# EAGLE board vrs6907 (EAGLE 6.6.0)
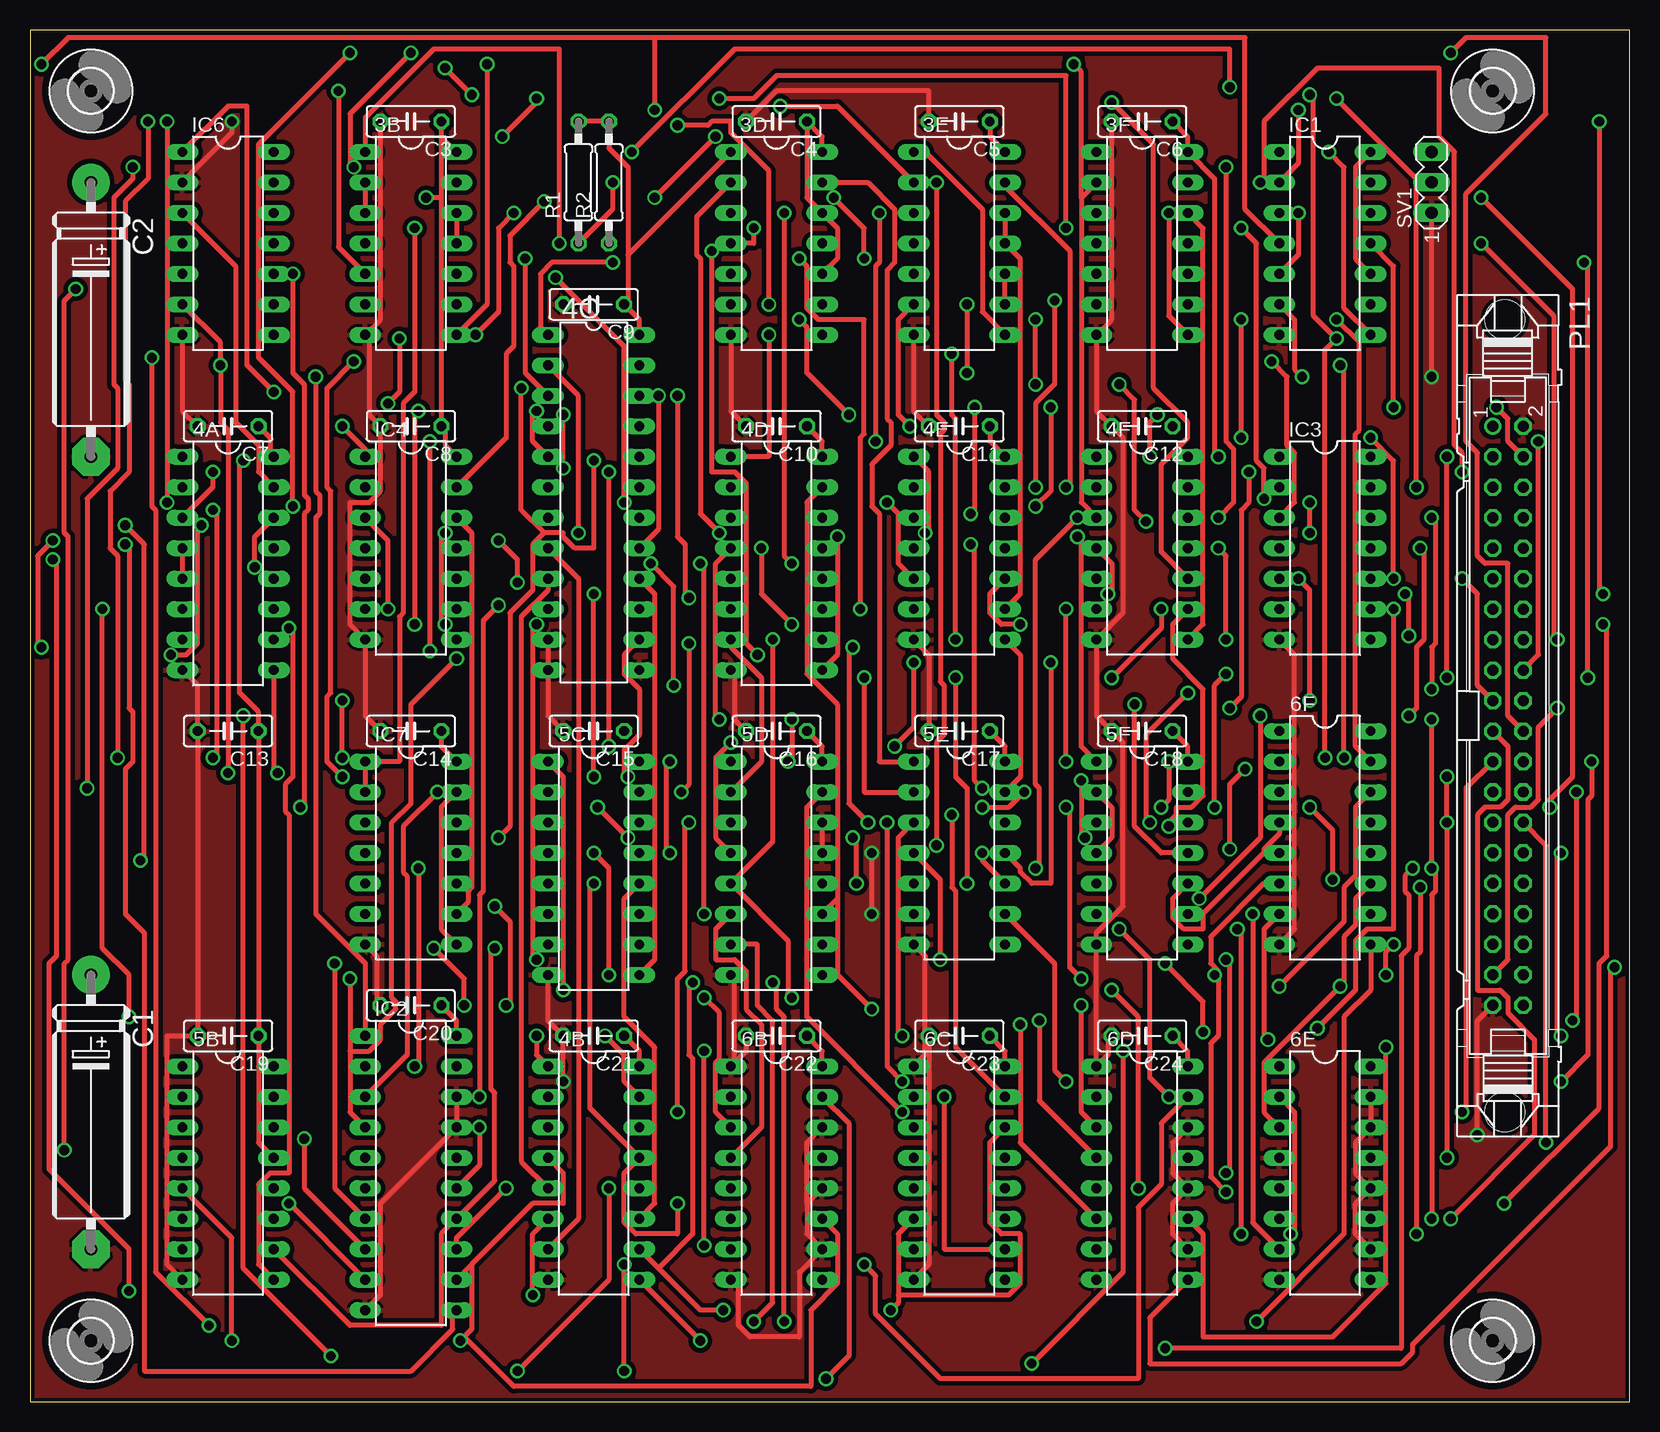
[diagram p1: board, top side]
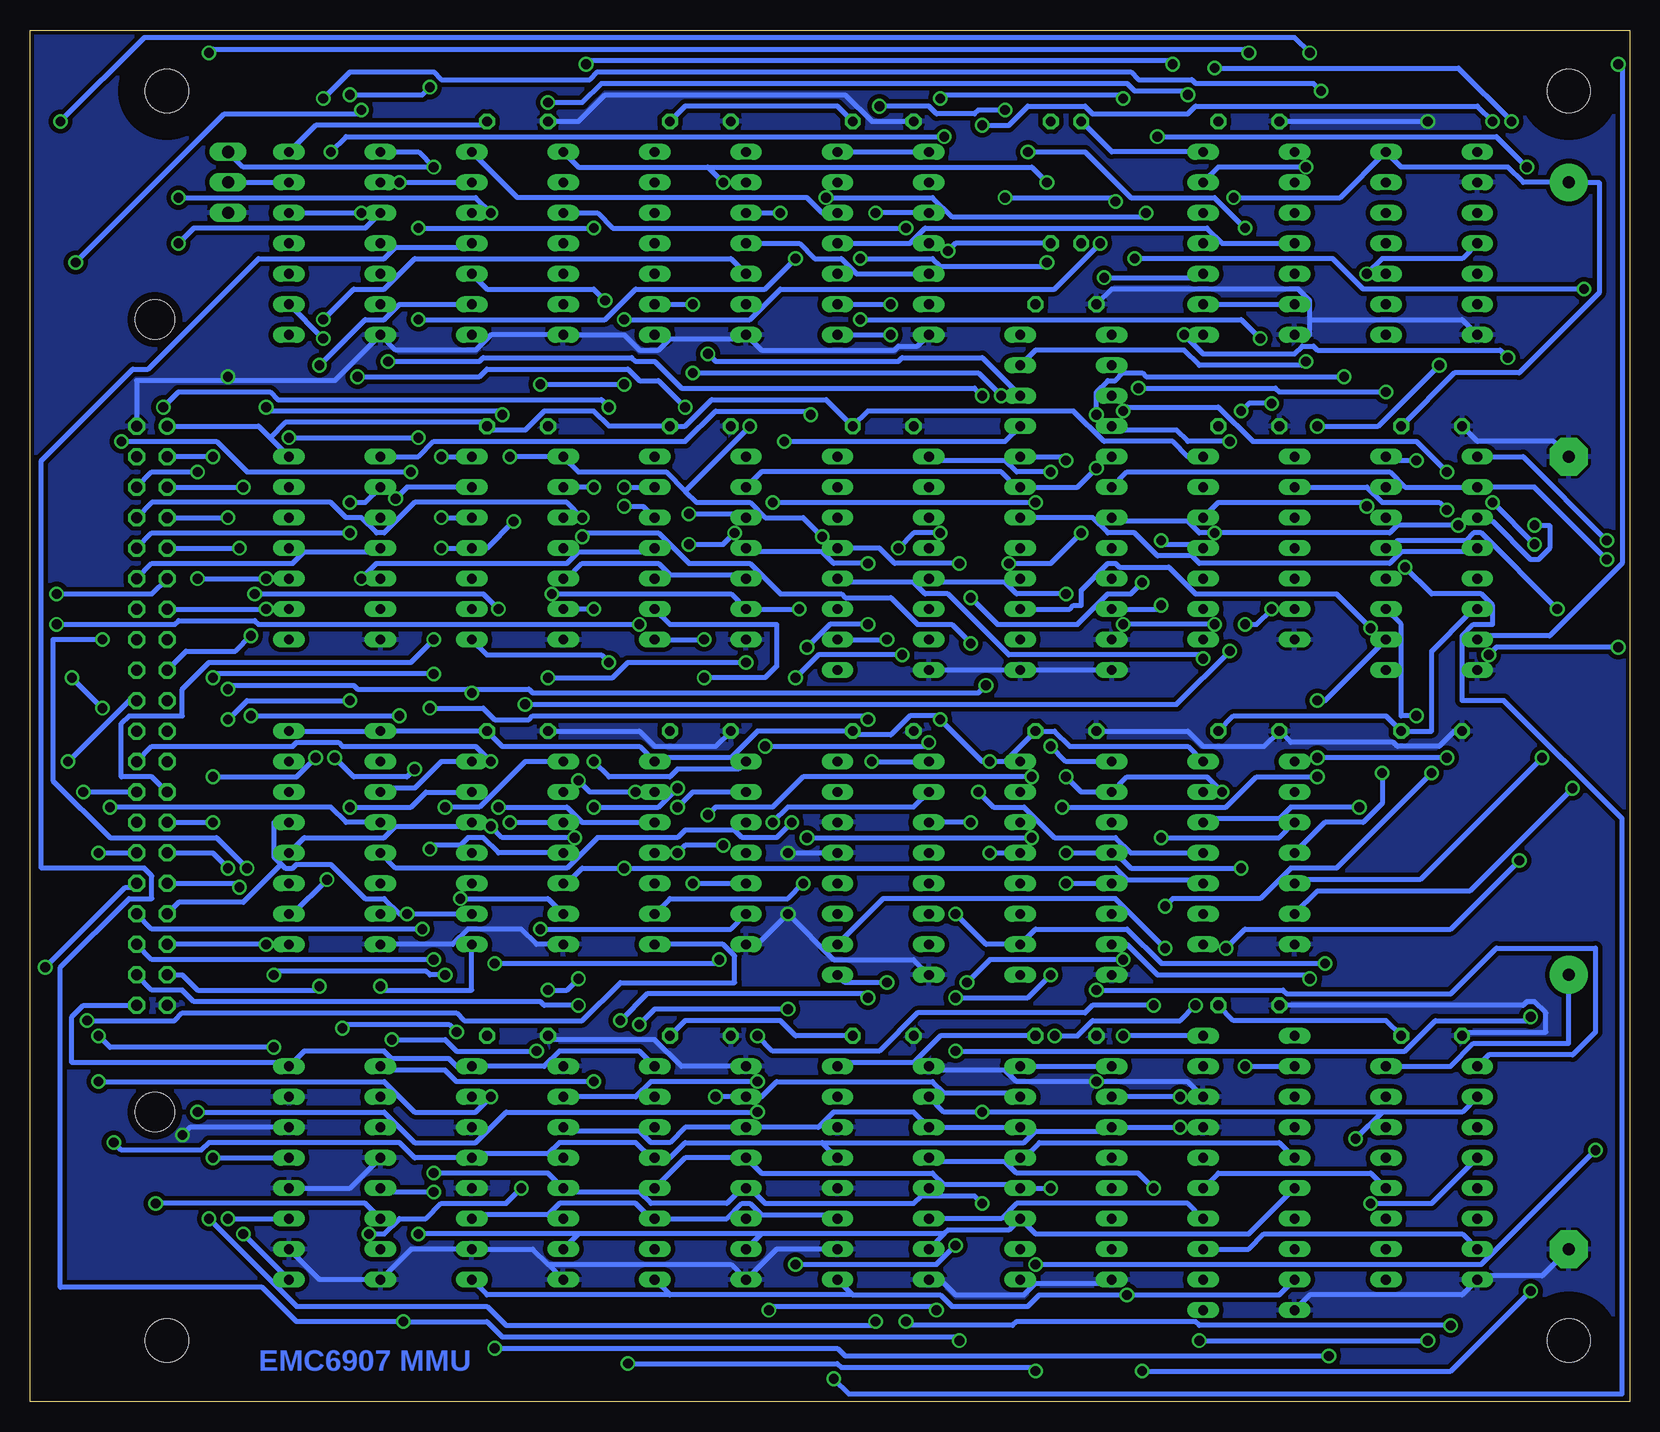
[diagram p2: board, bottom side, seen from below]

Size 133.35 x 114.3 mm. Coordinates in mm from the lower left corner, seen from the top.
Outline: 0,0 133.35,0 133.35,114.3 0,114.3 0,0
Copper layers (1+16): Top 0.035mm / dielectric 1.5mm / Bottom 0.035mm
Design rules "16mils": minimum track width 16mil, minimum drill 32mil, track to track 15mil, track to pad 10mil, pad to pad 10mil, via to via 10mil, smd to smd 10mil, copper to edge 13mil, drill to drill 10mil, minimum pad ring 10mil, minimum via ring 8mil, stop-mask expansion 0mil, vias tented up to drill 0mil, thermal gap 10mil

## Footprints (pad centres in the part's own frame; a part is rotated, then mirrored left to right if it is on the bottom)
DIL14 = drill 0.813 long: 1 -7.62,-3.81; 2 -5.08,-3.81; 3 -2.54,-3.81; 4 0,-3.81; 5 2.54,-3.81; 6 5.08,-3.81; 7 7.62,-3.81; 8 7.62,3.81; 9 5.08,3.81; 10 2.54,3.81; 11 0,3.81; 12 -2.54,3.81; 13 -5.08,3.81; 14 -7.62,3.81
DIL16 = drill 0.813 long: 1 -8.89,-3.81; 2 -6.35,-3.81; 3 -3.81,-3.81; 4 -1.27,-3.81; 5 1.27,-3.81; 6 3.81,-3.81; 7 6.35,-3.81; 8 8.89,-3.81; 9 8.89,3.81; 10 6.35,3.81; 11 3.81,3.81; 12 1.27,3.81; 13 -1.27,3.81; 14 -3.81,3.81; 15 -6.35,3.81; 16 -8.89,3.81
DIL24-3 = drill 0.813 long: 1 -13.97,-3.81; 2 -11.43,-3.81; 3 -8.89,-3.81; 4 -6.35,-3.81; 5 -3.81,-3.81; 6 -1.27,-3.81; 7 1.27,-3.81; 8 3.81,-3.81; 9 6.35,-3.81; 10 8.89,-3.81; 11 11.43,-3.81; 12 13.97,-3.81; 13 13.97,3.81; 14 11.43,3.81; 15 8.89,3.81; 16 6.35,3.81; 17 3.81,3.81; 18 1.27,3.81; 19 -1.27,3.81; 20 -3.81,3.81; 21 -6.35,3.81; 22 -8.89,3.81; 23 -11.43,3.81; 24 -13.97,3.81
E22-6 = drill 1.016 pad 3.15: + -11.43,0 | drill 1.016 pad 3.15 octagon: - 11.43,0
C050-025X075 = drill 0.813 octagon: 1 -2.54,0; 2 2.54,0
DIL20 = drill 0.813 long: 1 -11.43,-3.81; 2 -8.89,-3.81; 3 -6.35,-3.81; 4 -3.81,-3.81; 5 -1.27,-3.81; 6 1.27,-3.81; 7 3.81,-3.81; 8 6.35,-3.81; 9 8.89,-3.81; 10 11.43,-3.81; 11 11.43,3.81; 12 8.89,3.81; 13 6.35,3.81; 14 3.81,3.81; 15 1.27,3.81; 16 -1.27,3.81; 17 -3.81,3.81; 18 -6.35,3.81; 19 -8.89,3.81; 20 -11.43,3.81
40V = drill 0.914: 1 -24.13,-1.27 | drill 0.914 octagon: 2 -24.13,1.27; 3 -21.59,-1.27; 4 -21.59,1.27; 5 -19.05,-1.27; 6 -19.05,1.27; 7 -16.51,-1.27; 8 -16.51,1.27; 9 -13.97,-1.27; 10 -13.97,1.27; 11 -11.43,-1.27; 12 -11.43,1.27; 13 -8.89,-1.27; 14 -8.89,1.27; 15 -6.35,-1.27; 16 -6.35,1.27; 17 -3.81,-1.27; 18 -3.81,1.27; 19 -1.27,-1.27; 20 -1.27,1.27; 21 1.27,-1.27; 22 1.27,1.27; 23 3.81,-1.27; 24 3.81,1.27; 25 6.35,-1.27; 26 6.35,1.27; 27 8.89,-1.27; 28 8.89,1.27; 29 11.43,-1.27; 30 11.43,1.27; 31 13.97,-1.27; 32 13.97,1.27; 33 16.51,-1.27; 34 16.51,1.27; 35 19.05,-1.27; 36 19.05,1.27; 37 21.59,-1.27; 38 21.59,1.27; 39 24.13,-1.27; 40 24.13,1.27 | hole 3.302: 33.02,-0.254; -33.02,-0.254
0207/10 = drill 0.813 octagon: 1 -5.08,0; 2 5.08,0
MA03-1 = drill 1.016 long: 1 -2.54,0; 2 0,0; 3 2.54,0
3,6 = hole 3.6: 0,0

## Placement (x,y rotation side)
3B  7414N  [DIL14]  31.75,96.52 270 top
3D  74LS74N  [DIL14]  62.23,96.52 270 top
3E  74LS10N  [DIL14]  77.47,96.52 270 top
3F  74LS00N  [DIL14]  92.71,96.52 270 top
4A  74LS138N  [DIL16]  16.51,69.85 270 top
4B  74LS174N  [DIL16]  46.99,19.05 270 top
4C  20L10  [DIL24-3]  46.99,74.93 270 top
4D  74LS175N  [DIL16]  62.23,69.85 270 top
4E  74LS02N  [DIL14]  77.47,71.12 270 top
4F  74LS04N  [DIL14]  92.71,71.12 270 top
5B  74LS175N  [DIL16]  16.51,19.05 270 top
5C  74LS175N  [DIL16]  46.99,44.45 270 top
5D  74LS257N  [DIL16]  62.23,44.45 270 top
5E  7407N  [DIL14]  77.47,45.72 270 top
5F  74LS32N  [DIL14]  92.71,45.72 270 top
6B  74LS365N  [DIL16]  62.23,19.05 270 top
6C  74LS365N  [DIL16]  77.47,19.05 270 top
6D  74LS365N  [DIL16]  92.71,19.05 270 top
6E  74LS365N  [DIL16]  107.95,19.05 270 top
6F  74LS174N  [DIL16]  107.95,46.99 270 top
C1  27uf  [E22-6]  5.08,24.13 270 top
C2  27uf  [E22-6]  5.08,90.17 270 top
C3  .01uf  [C050-025X075]  31.75,106.68 180 top
C4  .01uf  [C050-025X075]  62.23,106.68 180 top
C5  .01uf  [C050-025X075]  77.47,106.68 180 top
C6  .01uf  [C050-025X075]  92.71,106.68 180 top
C7  .01uf  [C050-025X075]  16.51,81.28 180 top
C8  .01uf  [C050-025X075]  31.75,81.28 180 top
C9  .01uf  [C050-025X075]  46.99,91.44 180 top
C10  .01uf  [C050-025X075]  62.23,81.28 180 top
C11  .01uf  [C050-025X075]  77.47,81.28 180 top
C12  .01uf  [C050-025X075]  92.71,81.28 180 top
C13  .01uf  [C050-025X075]  16.51,55.88 180 top
C14  .01uf  [C050-025X075]  31.75,55.88 180 top
C15  .01uf  [C050-025X075]  46.99,55.88 180 top
C16  .01uf  [C050-025X075]  62.23,55.88 180 top
C17  .01uf  [C050-025X075]  77.47,55.88 180 top
C18  .01uf  [C050-025X075]  92.71,55.88 180 top
C19  .01uf  [C050-025X075]  16.51,30.48 180 top
C20  .01uf  [C050-025X075]  31.75,33.02 180 top
C21  .01uf  [C050-025X075]  46.99,30.48 180 top
C22  .01uf  [C050-025X075]  62.23,30.48 180 top
C23  .01uf  [C050-025X075]  77.47,30.48 180 top
C24  .01uf  [C050-025X075]  92.71,30.48 180 top
IC1  74LS74N  [DIL14]  107.95,96.52 270 top
IC2  74LS374N  [DIL20]  31.75,19.05 270 top
IC3  7407N  [DIL14]  107.95,71.12 270 top
IC4  74LS32N  [DIL14]  31.75,71.12 270 top
IC6  74LS74N  [DIL14]  16.51,96.52 270 top
IC7  74LS10N  [DIL14]  31.75,45.72 270 top
PL1  [40V]  123.19,57.15 270 top
R1  [0207/10]  45.72,101.6 90 top
R2  [0207/10]  48.26,101.6 90 top
SV1  [MA03-1]  116.84,101.6 90 top
U$1  [3,6]  5.08,109.22 0 top
U$2  [3,6]  121.92,109.22 0 top
U$3  [3,6]  5.08,5.08 0 top
U$4  [3,6]  121.92,5.08 0 top

## Tracks (layer width: path | path; a pad name or v marks a point on that pad's centre or on a via)
!2X4
  Top 0.406: 4A.4 4A.5
  Bottom 0.406: 4C.18 44.77,73.66 43.5,72.39 41.27,72.39 39.37,70.48 36.51,70.48 35.88,69.85 20,69.85 19.05,70.8 13.02,70.8 4A.4
!C0  (via drill 0.81)
  Top 0.406: v94.3,49.53 94.93,50.16 v94.93,53.34
  Bottom 0.406: 5E.12 87.31,48.26 88.58,49.53 v94.3,49.53 | v94.93,53.34 96.2,54.61 107.31,54.61 107.63,54.93 111.12,54.93 111.44,54.61 123.19,54.61 PL1.24
!C1  (via drill 0.81)
  Top 0.406: v128.59,31.75 128.91,32.07 v128.91,50.8
  Bottom 0.406: 5E.8 75.56,38.1 74.61,37.15 74.61,34.92 84.14,34.92 87.31,31.75 97.16,31.75 97.79,32.38 120.65,32.38 121.28,31.75 v128.59,31.75 | PL1.26 v128.91,50.8
!CINT
  Top 0.406: 4A.15 19.05,77.47 19.05,79.69 17.14,81.6 17.14,94.61 IC6.3
!CPUDEVSEL  (via drill 0.81)
  Top 0.406: v54.29,50.8 54.93,51.44 v54.93,63.18 | v87.31,72.07 87.63,71.75 87.63,54.61 5F.1 | v118.11,60.33 v118.11,78.74 | v99.69,60.64 98.74,59.69 v98.74,49.53
  Bottom 0.406: IC7.11 41.59,45.72 42.86,46.99 47.94,46.99 50.48,49.53 53.02,49.53 v54.29,50.8 | v54.93,63.18 56.52,64.77 59.37,64.77 61.59,66.99 65.41,66.99 65.72,67.31 70.8,67.31 73.34,69.85 78.42,69.85 80.96,72.39 87,72.39 v87.31,72.07 | v118.11,78.74 PL1.3 | v118.11,60.33 117.79,60.64 v99.69,60.64 | v98.74,49.53 95.89,49.53 92.08,53.34 5F.1
!CPUSWSEL  (via drill 0.81)
  Top 0.406: v87.31,73.66 83.82,70.17 83.82,51.44 84.14,51.12 84.14,44.77 v83.82,44.45
  Bottom 0.406: IC7.10 35.88,43.5 41.91,43.5 42.86,44.45 v83.82,44.45 87.31,44.45 88.58,43.18 5F.5 | PL1.8 123.19,74.93 108.27,74.93 107,73.66 105.73,73.66 104.46,72.39 103.82,72.39 101.28,74.93 88.58,74.93 v87.31,73.66
!CUF  (via drill 0.81)
  Top 0.406: v20.64,52.39 20.32,52.7 4A.9
  Bottom 0.406: IC7.4 25.4,48.26 22.23,48.26 20.64,49.85 v20.64,52.39
!DEVSEL  (via drill 0.81)
  Top 0.406: v93.34,48.26 93.03,48.58 93.03,55.56 v96.52,59.05 | v116.84,59.37 116.84,62.87 117.16,63.18 117.16,73.34 v116.84,73.66 | 4C.2 45.72,83.82 v45.72,72.39 | v51.75,69.85 53.66,67.94 v53.66,59.69
  Bottom 0.406: v93.34,48.26 5F.3 | 96.84,59.37 106.05,59.37 106.36,59.69 116.52,59.69 v116.84,59.37 | PL1.7 v116.84,73.66 | v45.72,72.39 48.26,69.85 v51.75,69.85 | v53.66,59.69 54.29,59.05 91.44,59.05 91.76,59.37 96.84,59.37 | 96.84,59.37 v96.52,59.05
!ENSF  (via drill 0.81)
  Top 0.406: IC2.1 27.94,36.51 23.81,40.64 23.81,73.66 24.13,73.98 24.13,75.56 23.81,75.88 v23.81,85.41 | v44.45,77.79 v44.45,82.23
  Bottom 0.406: v23.81,85.41 40.32,85.41 40.64,85.72 42.23,85.72 42.86,85.09 43.5,85.09 44.45,84.14 v44.45,82.23 | v44.45,77.79 46.04,76.2 4C.19 51.12,76.2 52.39,77.47 72.39,77.47 4E.2
!ERROR  (via drill 0.81)
  Top 0.406: v22.54,49.53 22.86,49.85 22.86,73.98 23.18,74.3 23.18,75.25 22.86,75.56 22.86,84.77 21.91,85.72 v21.91,93.98
  Bottom 0.406: IC7.12 35.24,48.58 29.21,48.58 28.26,49.53 v22.54,49.53 | v21.91,93.98 20.64,95.25 13.97,95.25 IC6.4
!GTF  (via drill 0.81)
  Top 0.406: 5E.13 82.55,52.07 82.55,62.23 4E.8 | v76.83,87.31 76.83,82.23 77.15,81.92 v77.15,63.5
  Bottom 0.406: 4C.22 53.98,87 60.64,87 60.96,86.68 76.2,86.68 v76.83,87.31 | 4E.8 v77.15,63.5
!INHIBIT  (via drill 0.81)
  Top 0.406: 3E.12 3E.11 82.55,95.25 82.55,67.31 4E.9 | v78.11,43.18 78.11,51.12 77.15,52.07 v77.15,60.33
  Bottom 0.406: v78.11,43.18 5E.5 | v77.15,60.33 72.07,60.33 71.12,61.28 71.12,64.77 80.01,64.77 4E.9
!INHSET  (via drill 0.81)
  Top 0.406: 4C.17 52.39,72.71 v52.39,83.82 | v78.11,91.44 v78.11,85.72 | 3E.9 3E.10
  Bottom 0.406: v52.39,83.82 54.29,85.72 v78.11,85.72 | 3E.9 v78.11,91.44
!INTGNT  (via drill 0.81)
  Top 0.406: v7.3,53.66 7.3,70.48 6.67,71.12 6.67,75.88 8.26,77.47 8.26,84.77 7.94,85.09 7.94,100.01 9.84,101.92 v9.84,106.68 | v36.83,108.9 v34.61,111.12 | v90.17,108.27 93.66,104.78 93.66,84.45 96.52,81.6 96.52,80.33 94.3,78.11 94.3,70.8 4F.10
  Bottom 0.406: IC7.5 27.62,43.5 17.46,43.5 v7.3,53.66 | v9.84,106.68 14.29,111.12 v34.61,111.12 | v36.83,108.9 37.15,109.22 41.27,109.22 41.91,109.86 85.72,109.86 87.31,108.27 v90.17,108.27
!INTREQ  (via drill 0.81)
  Top 0.406: 5E.4 75.88,43.5 v75.88,36.83 | v94.61,36.51 97.79,33.34 v97.79,30.8 | v107.31,31.11 110.49,34.29 110.49,38.42 111.44,39.37 113.67,39.37 v113.67,66.04
  Bottom 0.406: v75.88,36.83 76.2,36.51 v94.61,36.51 | v97.79,30.8 98.42,31.43 107,31.43 v107.31,31.11 | PL1.13 v113.67,66.04
!IOCLR  (via drill 0.81)
  Top 0.406: v39.05,46.99 40.01,47.94 40.01,65.72 41.91,67.63 41.91,71.44 42.86,72.39 | 42.86,72.39 44.45,72.39 44.45,72.07 45.4,71.12 46.99,71.12 v46.99,78.42 | IC6.1 16.51,107.95 18.1,107.95 18.1,86.36 v20.32,84.14 | v40.96,84.45 40.96,74.3 42.86,72.39
  Bottom 0.406: IC7.3 29.21,46.99 v39.05,46.99 | v46.99,78.42 47.31,78.74 4C.20 | v20.32,84.14 29.21,84.14 29.53,84.45 v40.96,84.45
!MEMSEL  (via drill 0.81)
  Top 0.406: v83.82,74.61 85.09,75.88 v85.09,82.87 | v122.24,82.87 123.19,81.92 123.19,80.01 PL1.4
  Bottom 0.406: 4E.12 82.23,74.61 v83.82,74.61 | v85.09,82.87 85.72,83.5 112.71,83.5 113.35,84.14 120.97,84.14 v122.24,82.87
!RDF  (via drill 0.81)
  Top 0.406: 4A.14 18.73,72.07 v18.73,69.53 | v66.36,1.91 68.26,3.81 68.26,23.18 6B.15
  Bottom 0.406: v18.73,69.53 16.51,67.31 12.38,67.31 11.43,66.36 11.43,64.77 13.02,64.77 13.97,63.82 13.97,58.42 10.48,58.42 0.64,48.58 0.64,0.64 65.09,0.64 v66.36,1.91
!RIF  (via drill 0.81)
  Top 0.406: v6.03,66.04 6.03,37.78 8.26,35.56 v8.26,32.07 | v56.2,13.02 v56.2,29.21 | v69.53,11.43 70.48,10.48 70.48,7.3 75.88,1.91 92.39,1.91 92.39,16.19 94.3,18.1 94.3,23.18 6D.15
  Bottom 0.406: 4A.13 20,71.44 19.68,71.44 19.37,71.75 13.65,71.75 13.02,72.39 12.38,72.39 v6.03,66.04 | v8.26,32.07 8.57,31.75 16.19,31.75 18.73,29.21 v56.2,29.21 | v56.2,13.02 57.78,11.43 v69.53,11.43
!RMEN  (via drill 0.81)
  Top 0.406: v86.36,26.67 85.41,27.62 85.41,36.51 5E.9 | v26.99,86.68 24.77,84.45 24.77,76.2 25.08,75.88 25.08,59.05 24.77,58.74 24.77,53.34 v26.04,52.07 | v49.85,46.99 v47.31,49.53 | v68.58,46.99 68.9,46.67 v68.9,43.18
  Bottom 0.406: 6E.1 103.82,27.62 98.74,27.62 97.79,26.67 v86.36,26.67 | 4C.23 49.53,87.63 37.15,87.63 35.88,86.36 27.3,86.36 v26.99,86.68 | v26.04,52.07 31.11,52.07 33.66,49.53 v47.31,49.53 | v68.58,46.99 v49.85,46.99 | v68.9,43.18 70.17,41.91 80.01,41.91 5E.9
!RMF  (via drill 0.81)
  Top 0.406: v17.78,57.15 17.78,11.11 v25.08,3.81 | v94.61,4.45 114.3,4.45 114.3,37.15 114.94,37.78 114.94,42.23 114.62,42.55 114.62,43.81 v115.25,44.45 | v127.32,63.5 127,63.82 127,90.49 v120.97,96.52
  Bottom 0.406: 4A.11 19.05,64.77 19.05,57.15 v17.78,57.15 | v25.08,3.81 65.41,3.81 66.04,4.45 v94.61,4.45 | v115.25,44.45 117.79,46.99 126.68,46.99 131.44,51.75 131.44,63.5 v127.32,63.5 | v120.97,96.52 119.7,97.79 105.41,97.79 IC1.3
!RUNHLT
  Bottom 0.406: IC3.4 104.46,70.8 110.49,70.8 111.44,69.85 123.19,69.85 PL1.12
!SELIR  (via drill 0.81)
  Top 0.406: 6C.15 77.15,29.53 77.15,42.55 76.83,42.86 v76.83,48.9 | v49.85,52.07 49.53,52.39 49.53,54.29 50.8,55.56 50.8,59.37 49.53,60.64 49.53,62.23 4C.14
  Bottom 0.406: v76.83,48.9 76.2,49.53 71.44,49.53 68.9,52.07 v49.85,52.07
!SINT  (via drill 0.81)
  Top 0.406: v26.04,53.66 v26.04,58.42 | v15.24,53.66 15.56,53.98 15.56,73.98 v15.24,74.3
  Bottom 0.406: 4A.10 25.4,58.42 v26.04,58.42 | v15.24,53.66 v26.04,53.66 | v15.24,74.3 15.88,74.93 20.64,74.93 21.91,76.2 IC4.2
!SKP  (via drill 0.81)
  Top 0.406: v106.68,72.39 v106.68,74.93
  Bottom 0.406: IC3.2 105.41,74.93 v106.68,74.93 | v106.68,72.39 123.19,72.39 PL1.10
!SUF  (via drill 0.81)
  Top 0.406: v0.95,111.44 3.17,113.67 52.07,113.67 | 52.07,113.67 101.28,113.67 101.28,99.38 IC1.4 | 3E.2 67.31,107.95 v62.55,107.95 | 52.07,113.67 v52.07,107.63
  Bottom 0.406: 4A.7 12.38,63.82 6.67,63.82 0.64,69.85 0.64,111.44 v0.95,111.44 | v62.55,107.95 58.42,107.95 57.78,107.31 54.61,107.31 54.29,107.63 v52.07,107.63
!SWSEL  (via drill 0.81)
  Top 0.406: v97.47,41.91 102.55,46.99 v102.55,57.15 | v114.94,57.15 115.57,57.78 115.57,62.87 116.2,63.5 116.2,70.8 v115.89,71.12
  Bottom 0.406: 5F.6 90.17,41.91 v97.47,41.91 | v114.94,57.15 v102.55,57.15 | PL1.9 v115.89,71.12
!UB  (via drill 0.81)
  Top 0.406: v78.42,73.98 78.74,74.3 v78.74,82.87 | v106.05,85.41 105.41,86.04 105.41,90.17 IC1.6
  Bottom 0.406: 4E.3 73.98,73.98 v78.42,73.98 | v78.74,82.87 80.96,85.09 82.55,85.09 83.5,86.04 95.25,86.04 95.89,85.41 v106.05,85.41
!UIF  (via drill 0.81)
  Top 0.406: IC6.6 15.88,88.27 v15.88,86.36 15.88,81.6 16.51,80.96 v16.51,52.39 | v26.04,81.28 27.94,79.38 IC4.1 | 5E.3 72.39,46.99 72.39,30.8 v72.71,30.48 | v39.69,33.02 40.01,33.34 40.01,40.01 v38.73,41.27
  Bottom 0.406: v15.88,86.36 20.95,81.28 v26.04,81.28 | v72.71,30.48 71.44,29.21 62.55,29.21 59.37,32.38 45.4,32.38 44.77,33.02 v39.69,33.02 | v38.73,41.27 38.1,41.91 30.8,41.91 28.26,44.45 24.45,44.45 v16.51,52.39
!USER_MODE  (via drill 0.81)
  Top 0.406: IC4.13 39.69,80.33 39.69,87.31 40.32,87.95 40.32,94.61 40.01,94.93 40.01,97.16 v42.86,100.01 | v57.15,105.41 v52.07,100.33 | v108.27,104.14 109.54,102.87 109.54,91.12 IC1.8
  Bottom 0.406: v42.86,100.01 43.18,100.33 v52.07,100.33 | v57.15,105.41 107,105.41 v108.27,104.14
ANYJ  (via drill 0.81)
  Top 0.406: v69.85,48.26 68.26,49.85 68.26,62.55 v68.58,62.87 | v63.5,64.77 60.96,67.31 v60.96,71.12 | v57.47,72.39 55.88,73.98 55.88,95.25 55.56,95.57 55.56,98.74 3D.2
  Bottom 0.406: 6F.5 102.87,44.45 88.58,44.45 86.04,46.99 79.38,46.99 78.74,47.62 74.61,47.62 73.98,46.99 71.12,46.99 v69.85,48.26 | v68.58,62.87 66.67,64.77 v63.5,64.77 | v60.96,71.12 59.69,72.39 v57.47,72.39
CLKDF  (via drill 0.81)
  Top 0.406: 5B.9 19.05,11.43 19.05,18.1 20,19.05 21.59,19.05 21.59,48.9 21.27,49.21 21.27,51.44 21.91,52.07 21.91,64.14 v21.59,64.45
  Bottom 0.406: v21.59,64.45 24.45,67.31 36.2,67.31 38.42,69.53 42.55,69.53 42.86,69.85 43.5,69.85 45.72,67.63 45.72,66.36 46.35,66.36 46.67,66.04 4C.15
CLKIB
  Top 0.406: 5C.9 52.07,36.83 52.07,67.31 4C.16
CLKIF  (via drill 0.81)
  Top 0.406: v70.48,80.01 70.48,94.61 70.8,94.93 v70.8,99.06
  Bottom 0.406: 4C.21 52.07,80.01 v70.48,80.01 | 3E.3 v70.8,99.06
DATAF  (via drill 0.81)
  Top 0.406: v63.18,53.34 63.5,53.66 v63.5,56.83 | v100.01,57.78 100.97,58.74 100.97,74.3 101.6,74.93 v101.6,77.47 | v125.73,80.01 125.73,62.23 PL1.18
  Bottom 0.406: v63.18,53.34 5D.1 | v63.5,56.83 63.82,57.15 91.44,57.15 91.76,56.83 94.61,56.83 95.57,57.78 v100.01,57.78 | v101.6,77.47 115.25,77.47 117.79,80.01 v125.73,80.01
DIRJ  (via drill 0.81)
  Top 0.406: v108.9,90.17 110.81,88.27 110.81,80.96 110.49,80.64 110.49,54.61 6F.15
  Bottom 0.406: 3E.5 74.93,95.25 101.28,95.25 103.82,92.71 106.36,92.71 v108.9,90.17
DMAGNT  (via drill 0.81)
  Top 0.406: 5D.15 64.77,49.53 64.77,32.07 v72.71,24.13 | v119.38,24.13 119.7,24.45 119.7,51.12 PL1.23
  Bottom 0.406: v72.71,24.13 93.66,24.13 96.2,21.59 101.28,21.59 103.82,24.13 v119.38,24.13
DX0  (via drill 0.81)
  Top 0.406: v118.11,20.32 v118.11,48.26 v118.11,52.07 | v109.22,86.36 109.54,86.04 v109.54,53.66
  Bottom 0.406: v118.11,20.32 6E.13 | PL1.27 v118.11,48.26 | 3F.9 102.55,91.44 103.82,90.17 105.41,90.17 v109.22,86.36 | v109.54,53.66 111.12,52.07 v118.11,52.07
DX1  (via drill 0.81)
  Top 0.406: v116.84,15.24 116.84,42.23 117.16,42.55 117.16,44.13 v116.84,44.45 v116.84,56.83 | v105.73,68.58 106.68,67.63 v106.68,58.42
  Bottom 0.406: v116.84,15.24 6E.11 | v116.84,44.45 118.11,45.72 PL1.29 | 4E.11 81.6,70.8 87.63,70.8 88.58,69.85 104.46,69.85 v105.73,68.58 | v106.68,58.42 115.25,58.42 v116.84,56.83
DX2  (via drill 0.81)
  Top 0.406: v115.57,13.97 115.57,37.15 115.89,37.47 v115.89,42.86
  Bottom 0.406: v115.57,13.97 6E.9 | v115.89,42.86 116.2,43.18 PL1.31
DX3  (via drill 0.81)
  Top 0.406: 6E.7 101.92,14.92 v101.92,40.64
  Bottom 0.406: 5F.9 v101.92,40.64 102.55,40.64 103.82,41.91 105.41,41.91 108.27,44.77 111.12,44.77 111.44,44.45 112.08,44.45 112.39,44.77 | 112.39,44.77 113.03,45.4 113.03,48.26 6F.13 | PL1.33 120.97,41.59 115.57,41.59 112.39,44.77
DX4  (via drill 0.81)
  Top 0.406: v99.69,17.46 98.42,18.73 98.42,29.84 99.06,30.48 99.06,35.56 | 99.06,35.56 99.06,35.88 98.42,36.51 98.42,38.73 102.87,43.18 6F.6 | v113.67,38.1 113.03,37.47 v113.03,35.56 | 99.06,35.56 v98.74,35.56
  Bottom 0.406: 6E.5 103.82,17.46 v99.69,17.46 | v113.67,38.1 PL1.35 | v113.03,35.56 112.71,35.88 100.33,35.88 100.01,35.56 v98.74,35.56
DX5  (via drill 0.81)
  Top 0.406: 6E.3 102.87,24.13 102.87,28.26 v109.22,34.61 109.54,34.92 109.54,38.73 110.49,39.69 110.49,41.91 6F.11 | IC1.2 105.73,103.19 v105.73,107.63 | v129.54,94.93 129.86,94.61 v129.86,60.33 | v127.32,57.78 125.73,56.2 125.73,50.16 125.09,49.53 123.83,49.53 123.19,48.9 123.19,36.83 PL1.37
  Bottom 0.406: v105.73,107.63 106.05,107.31 117.16,107.31 v129.54,94.93 | v127.32,57.78 v129.86,60.33 | v109.22,34.61 109.54,34.29 119.38,34.29 120.65,35.56 PL1.37
DX6  (via drill 0.81)
  Top 0.406: v32.07,27.94 32.38,28.26 v32.38,44.45 | v87.63,33.02 87.63,24.13 6D.3 | v46.99,45.72 48.26,44.45 v48.26,35.56 | v56.2,33.66 57.47,32.38 57.47,28.57 57.15,28.26 57.15,24.13 6B.3
  Bottom 0.406: v32.07,27.94 IC2.2 | v32.38,44.45 41.59,44.45 42.86,45.72 5C.4 v46.99,45.72 | 4B.14 6B.3 59.69,24.13 66.36,24.13 67.63,22.86 6C.3 78.74,22.86 80.01,21.59 81.6,21.59 82.55,22.54 88.58,22.54 6D.3 | PL1.38 123.19,34.29 120.65,34.29 119.7,33.34 90.81,33.34 90.49,33.02 v87.63,33.02 | v48.26,35.56 50.16,33.66 v56.2,33.66
DX7  (via drill 0.81)
  Top 0.406: v46.99,43.18 46.67,42.86 46.67,24.45 4B.13 49.53,19.05 49.53,14.92 50.48,13.97 53.98,13.97 v53.98,16.51 | v99.69,36.83 100.01,36.51 100.01,19.37 v99.69,19.05
  Bottom 0.406: IC2.5 29.21,21.59 49.21,21.59 50.48,20.32 4B.13 | v46.99,43.18 5C.5 | 59.05,17.14 59.69,16.51 72.07,16.51 73.34,17.78 6C.5 73.98,17.78 75.25,16.51 81.6,16.51 82.55,17.46 88.58,17.46 6D.5 90.17,19.05 v99.69,19.05 | 59.05,17.14 6B.5 | PL1.36 123.19,36.83 v99.69,36.83 | v53.98,16.51 54.61,17.14 59.05,17.14
DX8  (via drill 0.81)
  Top 0.406: 5C.12 49.53,41.91 49.53,32.07 52.07,29.53 52.07,16.51 4B.11 | v100.65,39.37 100.97,39.05 v100.97,13.97
  Bottom 0.406: 57.15,13.97 56.83,14.29 51.75,14.29 4B.11 49.53,13.97 31.75,13.97 IC2.6 | 57.15,13.97 6B.7 | 72.39,13.97 6C.7 | 57.15,13.97 72.39,13.97 | 87.63,13.97 6D.7 | 72.39,13.97 87.63,13.97 | PL1.34 123.19,39.37 v100.65,39.37 | 87.63,13.97 v100.97,13.97
DX9  (via drill 0.81)
  Top 0.406: IC2.9 v21.59,16.51 | 4B.6 41.91,13.97 v41.91,8.89 | v132.08,36.2 131.76,35.88 131.76,21.27 115.25,4.76 115.25,4.13 114.3,3.17 93.34,3.17 93.34,6.99 6D.9
  Bottom 0.406: IC2.9 29.21,8.89 v41.91,8.89 49.21,8.89 50.16,7.94 56.52,7.94 57.47,8.89 64.77,8.89 | 6B.9 64.77,8.89 | 80.01,8.89 6C.9 | 64.77,8.89 80.01,8.89 | 5B.4 16.51,16.51 v21.59,16.51 | 6D.9 95.25,8.89 80.01,8.89 | PL1.32 124.78,42.86 125.41,42.86 v132.08,36.2
DX10  (via drill 0.81)
  Top 0.406: 36.83,11.43 41.91,16.51 44.45,16.51 44.45,19.05 4B.4 | 36.83,11.43 IC2.12 | 5B.5 16.83,13.65 v16.83,5.08 | 36.2,5.4 36.83,6.03 36.83,11.43 | v127.64,45.72 127.32,45.4 127.32,30.8 v127.64,30.48 | v113.03,29.53 113.03,9.84 108.58,5.4 97.79,5.4 97.79,13.97 6D.11 | 36.2,5.4 40.32,1.27 65.09,1.27 65.09,7.62 67.31,9.84 67.31,13.97 6B.11 | 36.2,5.4 v35.88,5.08
  Bottom 0.406: v35.88,5.08 v16.83,5.08 | 6B.11 66.36,15.56 72.39,15.56 73.34,16.51 73.98,16.51 75.25,15.24 6C.11 81.6,15.24 82.87,16.51 89.22,16.51 90.17,15.56 96.2,15.56 6D.11 | v127.64,45.72 PL1.30 | v127.64,30.48 126.68,29.53 v113.03,29.53
DX11  (via drill 0.81)
  Top 0.406: PL1.28 126.36,46.35 v126.36,21.59 | IC2.15 37.47,19.68 v37.47,22.86
  Bottom 0.406: 5B.12 21.59,19.05 34.29,19.05 IC2.15 | 67.31,21.59 6B.13 | 67.31,21.59 78.74,21.59 80.01,20.32 6C.13 81.6,20.32 82.87,21.59 89.22,21.59 90.17,20.64 96.2,20.64 6D.13 101.28,20.32 102.55,21.59 118.43,21.59 119.06,20.95 125.73,20.95 v126.36,21.59 | 67.31,21.59 50.48,21.59 49.53,22.54 43.5,22.54 4B.3 v37.47,22.86
EM0  (via drill 0.81)
  Top 0.406: 5D.4 57.15,46.99 57.15,53.66 v58.42,54.93 | v72.07,54.61 73.66,56.2 v73.66,61.59 | v90.17,60.33 94.3,64.45 v94.3,66.04 | v114.62,67.31 114.94,66.99 v114.94,63.82
  Bottom 0.406: v58.42,54.93 58.74,54.61 v72.07,54.61 | v73.66,61.59 83.5,61.59 84.77,60.33 v90.17,60.33 | v94.3,66.04 95.57,67.31 v114.62,67.31 | v114.94,63.82 116.2,62.55 120.33,62.55 PL1.17
EM1  (via drill 0.81)
  Top 0.406: 5D.7 60.64,38.1 60.64,33.02 61.91,31.75 61.91,8.26 v60.33,6.67 | v14.92,6.35 10.48,10.79 10.48,74.3 10.16,74.61 v10.16,87 | v37.15,88.9 39.05,90.81 39.05,97.79 v40.32,99.06 | v66.99,100.33 69.53,97.79 v69.53,95.25 | v100.97,80.33 v100.97,90.17 | v111.76,80.33 113.67,78.42 v113.67,68.58 | v119.38,68.58 120.65,67.31 120.65,59.69 PL1.19
  Bottom 0.406: v60.33,6.67 60.01,6.35 51.44,6.35 51.12,6.67 36.2,6.67 35.88,6.35 v14.92,6.35 | v10.16,87 10.79,87.63 26.04,87.63 26.35,87.95 27.3,87.95 27.94,87.31 35.56,87.31 v37.15,88.9 | v40.32,99.06 40.64,98.74 56.52,98.74 58.1,100.33 v66.99,100.33 | v69.53,95.25 72.07,92.71 82.87,92.71 85.41,90.17 v100.97,90.17 | v111.76,80.33 v100.97,80.33 | v119.38,68.58 v113.67,68.58
EM2  (via drill 0.81)
  Top 0.406: v61.91,34.92 62.23,34.61 62.23,32.7 62.87,32.07 v62.87,6.67 | v118.43,15.24 125.41,22.23 125.41,30.16 123.19,32.38 123.19,33.66 122.56,34.29 120.65,34.29 120.65,48.9 121.28,49.53 122.56,49.53 123.19,50.16 123.19,54.61 PL1.21
  Bottom 0.406: 5D.9 65.41,34.92 v61.91,34.92 | v62.87,6.67 63.18,6.35 93.66,6.35 95.25,7.94 111.12,7.94 v118.43,15.24
GND  (via drill 0.81)
  Top 0.406: C7.2 12.7,82.55 IC6.7 | IC6.2 16.83,105.73 v16.83,106.68 | C3.2 29.21,90.17 3B.7 28.26,88.58 28.26,82.23 C8.2 29.21,75.88 28.26,74.93 26.67,74.93 26.67,64.77 IC4.7 27.94,57.15 C14.2 | C16.2 58.74,56.83 58.74,60.64 4D.8 | 4C.11 4C.12 43.18,57.15 C15.2 | C20.2 28.89,33.34 28.89,37.15 IC7.7 | 4A.8 13.97,59.69 C13.2 C19.2 11.43,30.48 11.43,11.43 5B.8 | C10.2 58.42,82.55 3D.7 | C11.2 73.66,82.55 3E.7 | C17.2 74.93,62.23 4E.7 | C4.2 62.23,109.22 74.93,109.22 C5.2 | C6.2 90.17,90.17 3F.7 88.9,82.55 C12.2 91.12,80.33 91.12,65.72 4F.7 88.9,57.15 C18.2 91.12,54.93 91.12,41.27 88.9,39.05 5F.7 6D.1 89.85,28.89 89.85,30.16 C24.2 | v116.84,85.41 SV1.1 | 64.77,16.51 64.77,13.97 6B.10 64.14,10.79 64.14,5.4 60.01,5.4 59.05,6.35 59.05,9.53 6B.8 | 6B.12 64.77,16.51 | 6B.14 64.77,21.59 64.77,16.51 | 6E.15 6E.14 110.49,21.59 110.49,19.05 6E.12 110.49,16.51 110.49,13.97 6E.10 | PL1.39 120.65,31.75 v120.65,22.23 | 6D.14 95.25,21.59 95.25,19.05 6D.12 95.25,16.51 95.25,13.97 6D.10 | IC3.7 105.41,62.23 105.41,39.37 6F.8 | 58.74,28.26 59.69,29.21 C22.2 | 5D.8 58.74,35.24 58.74,28.26 | 58.74,28.26 6B.1 | 5D.14 5D.13 | 74.93,29.21 74.61,28.89 | 74.61,28.89 6C.1 | C23.2 74.93,29.21 | 5E.7 74.61,37.15 74.61,28.89 | v70.17,40.64 v70.17,45.72 | 5C.8 43.18,31.75 C21.2 v44.45,26.67 | IC2.18 IC2.17 29.21,16.51 29.21,8.89 IC2.10 | 6C.8 74.93,11.43 74.93,29.21
  Bottom 0.406: C7.2 12.7,80.01 6.35,80.01 C2.- | C3.2 v16.83,106.68 | C9.2 43.18,92.71 27.62,92.71 26.67,91.76 26.67,90.17 | 26.67,90.17 26.67,88.9 3B.7 | IC6.7 13.97,90.17 26.67,90.17 | 4C.12 4C.13 4D.8 | C15.2 36.83,55.88 35.56,54.61 30.48,54.61 C14.2 28.26,54.93 19.68,54.93 19.37,54.61 15.88,54.61 14.61,55.88 C13.2 | C20.2 8.89,33.02 8.57,33.34 7.94,33.34 6.99,32.38 6.99,30.8 13.65,30.8 C19.2 | 3D.7 59.37,87.95 60.96,87.95 61.28,87.63 72.39,87.63 3E.7 73.98,88.58 80.01,88.58 80.96,87.63 82.55,87.63 83.82,88.9 3F.7 94.93,88.9 96.2,87.63 102.87,87.63 IC1.7 107.95,85.09 116.84,85.09 | C17.2 76.2,54.61 81.28,54.61 82.55,55.88 C18.2 | PL1.2 124.46,85.09 116.84,85.09 | 116.84,85.09 v116.84,85.41 | C4.2 63.18,106.68 65.41,108.9 85.41,108.9 87.63,106.68 C6.2 | 4B.8 43.5,9.84 49.53,9.84 50.48,8.89 56.2,8.89 57.47,10.16 6B.8 | 6B.10 71.12,12.7 6C.8 74.93,11.43 90.17,11.43 | 6E.4 106.68,17.78 6E.12 | v120.65,22.23 120.02,22.86 6E.14 | 90.17,11.43 91.44,12.7 6D.10 101.6,12.7 6E.8 109.22,10.16 6E.10 | 90.17,11.43 6D.8 | 6F.8 98.11,38.1 96.84,39.37 92.39,39.37 91.12,38.1 5F.7 | v70.17,45.72 5D.13 | 5E.7 72.71,38.1 v70.17,40.64 66.36,36.83 59.69,36.83 5D.8 | C1.- 7.3,10.48 12.38,10.48 5B.8 13.97,8.89 26.67,8.89 IC2.10 | IC2.18 36.83,26.67 v44.45,26.67 51.12,26.67 52.07,27.62 58.1,27.62 6B.1 | C24.2 89.85,30.16 81.28,30.16 79.06,27.94 6C.1
  pour Top: 0,0 0,114.3 133.35,114.3 133.35,0
  pour Bottom: 0,0 0,114.3 133.35,114.3 133.35,0
IFETCH  (via drill 0.81)
  Top 0.406: v26.99,102.87 26.67,103.19 26.67,107.31 v31.75,112.39 | v118.43,112.39 119.7,113.67 126.36,113.67 126.36,107.31 119.7,100.65 119.7,80.01 120.65,79.06 120.65,70.48 121.28,69.85 123.19,69.85 123.19,57.15 PL1.22
  Bottom 0.406: 3B.13 34.29,102.87 v26.99,102.87 | v31.75,112.39 32.07,112.71 118.11,112.71 v118.43,112.39
INTDIS  (via drill 0.81)
  Top 0.406: v90.81,39.37 93.34,36.83 93.34,26.99 v94.93,25.4 | v127.64,26.67 129.86,28.89 129.86,50.16 130.18,50.48 v130.18,53.34
  Bottom 0.406: 5E.6 74.93,39.37 v90.81,39.37 | v94.93,25.4 96.2,24.13 101.28,24.13 103.82,26.67 v127.64,26.67 | v130.18,53.34 125.09,58.42 PL1.20
INTGNT  (via drill 0.81)
  Top 0.406: v99.06,71.12 99.69,70.48 v99.69,63.5 | 3B.1 27.94,107 33.66,112.71 44.13,112.71 v44.13,96.52 | v83.82,84.77 v83.82,90.17 | v90.81,84.77 92.08,83.5 92.08,74.3 v93.03,73.34
  Bottom 0.406: v99.06,71.12 4F.11 95.25,71.12 v93.03,73.34 | v99.69,63.5 101.6,61.59 118.43,61.59 120.65,59.37 120.65,57.15 125.09,57.15 125.73,56.52 125.73,52.07 123.19,52.07 PL1.25 | v44.13,96.52 47.94,92.71 70.8,92.71 73.34,90.17 v83.82,90.17 | v90.81,84.77 v83.82,84.77
IR3
  Bottom 0.406: 5F.12 96.84,47.94 102.87,47.94 103.82,46.99 110.49,46.99 6F.12
IR4  (via drill 0.81)
  Top 0.406: 4C.3 41.27,85.72 v41.27,95.25 | v3.81,92.71 2.86,91.76 2.86,72.39 3.17,72.07 3.17,36.83 2.86,36.51 v2.86,20.95 | v49.53,2.54 v49.53,11.43 | v83.5,3.17 91.12,10.79 v91.12,29.21 | v103.19,30.16 102.87,30.48 102.87,39.37 6F.7
  Bottom 0.406: v41.27,95.25 24.77,95.25 22.23,92.71 v3.81,92.71 | v2.86,20.95 12.38,11.43 v49.53,11.43 | v49.53,2.54 49.85,2.86 65.72,2.86 66.04,3.17 v83.5,3.17 | v91.12,29.21 97.79,29.21 98.74,30.16 v103.19,30.16
IR5  (via drill 0.81)
  Top 0.406: v106.68,49.53 108.58,47.62 v108.58,43.5
  Bottom 0.406: 5F.13 100.33,50.8 101.6,49.53 v106.68,49.53 | v108.58,43.5 111.44,40.64 6F.10
IR6  (via drill 0.81)
  Top 0.406: 4A.3 15.24,76.2 v15.24,77.47 | v42.23,82.55 41.91,82.23 41.91,80.01 4C.5 | 6C.10 76.2,12.7 v76.2,25.4 | v7.94,73.03 9.53,71.44 9.53,45.4 v9.21,45.09 | v33.66,37.78 36.2,35.24 v36.2,33.02 | v47.94,30.48 49.53,28.89 49.53,26.67 4B.15
  Bottom 0.406: v15.24,77.47 17.78,80.01 31.43,80.01 34.29,82.87 41.91,82.87 v42.23,82.55 | v76.2,25.4 6C.2 72.39,25.4 71.12,26.67 58.1,26.67 57.15,25.72 51.12,25.72 4B.15 | 4A.3 12.38,73.34 11.43,73.34 8.26,70.17 7.62,70.17 6.67,71.12 6.67,73.03 v7.94,73.03 | v9.21,45.09 14.92,39.37 32.07,39.37 v33.66,37.78 | v36.2,33.02 37.47,31.75 44.77,31.75 46.04,30.48 v47.94,30.48
IR7  (via drill 0.81)
  Top 0.406: v1.91,70.17 2.22,69.85 2.22,37.15 1.59,36.51 1.59,19.37 8.26,12.7 v8.26,9.21 | v40.64,2.54 48.26,10.16 v48.26,17.78
  Bottom 0.406: 4C.6 41.91,77.47 20,77.47 18.73,76.2 4A.2 7.94,76.2 v1.91,70.17 | 6C.12 78.74,20.32 6C.4 72.39,19.05 58.1,19.05 57.15,18.1 51.12,18.1 4B.12 v48.26,17.78 | v8.26,9.21 14.92,2.54 v40.64,2.54
IR8  (via drill 0.81)
  Top 0.406: 52.39,11.11 55.88,7.62 v57.78,7.62 | 52.39,11.11 4B.10 | v71.75,7.62 72.39,8.26 72.39,8.89 | 72.39,8.89 72.39,13.97 6C.6 | 6C.14 80.01,21.59 80.01,14.92 80.96,13.97 82.55,13.97 82.55,9.84 81.6,8.89 72.39,8.89 | v14.29,73.03 13.97,72.71 13.97,63.18 13.02,62.23 v11.75,62.23 | v0.95,62.87 0.64,63.18 0.64,70.48 v1.91,71.75 | 52.39,11.11 55.24,13.97 55.24,28.57 54.93,28.89 54.93,34.61 v55.24,34.92 | v42.23,36.83 41.91,37.15 41.91,64.45 v42.23,64.77 | v34.61,64.77 34.29,65.09 34.29,72.07 v34.61,72.39
  Bottom 0.406: v57.78,7.62 58.1,7.94 71.44,7.94 v71.75,7.62 | 4C.7 42.86,73.34 36.83,73.34 35.88,72.39 v34.61,72.39 20,72.39 19.37,73.03 v14.29,73.03 | v11.75,62.23 11.11,62.87 v0.95,62.87 | v1.91,71.75 8.89,78.74 4A.1 | v55.24,34.92 53.34,36.83 v42.23,36.83 | v34.61,64.77 v42.23,64.77
IR9
  Top 0.406: 4B.7 45.72,15.24 45.72,68.58 4C.8
IR10
  Top 0.406: 4B.5 40.96,20 40.96,65.41 43.18,67.63 4C.9
IR11  (via drill 0.81)
  Top 0.406: v37.47,25.4 37.47,42.23 37.78,42.55 37.78,65.09 v39.05,66.36
  Bottom 0.406: v37.47,25.4 4B.2 | v39.05,66.36 39.37,66.04 4C.10
LOADIF  (via drill 0.81)
  Top 0.406: 4D.9 67.31,62.23 v67.31,72.07 | 3E.6 72.39,90.17 72.39,82.23 v73.34,81.28 | IC1.11 113.67,94.61 v113.67,82.87 | v93.98,82.23 93.34,81.6 v93.34,78.74
  Bottom 0.406: v67.31,72.07 68.9,73.66 72.07,73.66 73.34,74.93 77.79,74.93 78.74,75.88 | 78.74,75.88 80.33,77.47 87.63,77.47 4F.1 v93.34,78.74 | 78.74,75.88 v73.34,81.28 | v113.67,82.87 113.35,82.55 94.3,82.55 v93.98,82.23
LOADIR  (via drill 0.81)
  Top 0.406: v55.88,5.08 4B.9 | v102.23,6.67 109.54,13.97 109.54,32.07 111.76,34.29 6F.9
  Bottom 0.406: v55.88,5.08 56.2,5.4 93.98,5.4 95.25,6.67 v102.23,6.67 111.12,6.67 113.98,9.53 130.81,9.53 130.81,36.2 125.09,41.91 123.19,41.91 123.19,43.81 123.83,44.45 132.4,44.45 132.4,78.42 124.78,86.04 123.51,86.04 114.3,95.25 103.82,95.25 102.87,96.2 96.84,96.2 3F.11
N$1
  Top 0.406: 3B.12 3B.11
N$2
  Bottom 0.406: 3B.9 3B.6
N$3  (via drill 0.81)
  Top 0.406: 4F.3 87.63,74.93 87.63,100.33 | 3F.2 87.63,100.33 | 3B.8 38.1,91.44 v38.1,111.44 | v87,111.44 87.63,110.81 87.63,100.33
  Bottom 0.406: v38.1,111.44 38.42,111.76 86.68,111.76 v87,111.44
N$4  (via drill 0.81)
  Top 0.406: v43.81,93.66 49.53,87.95 v49.53,74.93 | v71.44,74.93 72.39,73.98 72.39,69.85 4E.5
  Bottom 0.406: 4E.5 73.98,68.9 80.01,68.9 80.96,69.85 87.31,69.85 88.58,68.58 4F.5 | 3B.10 35.88,93.66 v43.81,93.66 | v71.44,74.93 v49.53,74.93
N$5  (via drill 0.81)
  Top 0.406: 5E.1 70.8,53.34 70.8,73.98 70.17,74.61 70.17,78.11 71.75,79.69 71.75,81.6 71.44,81.92 71.44,94.3 72.07,94.93 72.07,99.38 69.85,101.6 3D.13 | v86.36,53.34 v86.36,66.04
  Bottom 0.406: v86.36,66.04 4F.6 | v86.36,53.34 85.09,52.07 80.01,52.07 79.38,52.7 74.3,52.7 5E.1
N$6
  Bottom 0.406: 3D.5 64.45,93.98 65.72,95.25 67.94,95.25 69.22,96.52 3E.4
N$7  (via drill 0.81)
  Top 0.406: 5E.10 79.38,45.09 v79.38,45.72 | v75.56,46.35 75.56,54.93 76.2,55.56 76.2,59.69 75.88,60.01 75.88,80.64 76.2,80.96 76.2,81.6 75.56,82.23 v75.56,101.6 | R1.1 48.58,99.38 v48.58,101.6
  Bottom 0.406: v79.38,45.72 78.74,46.35 v75.56,46.35 | 76.83,102.87 v75.56,101.6 | 76.83,102.87 87.63,102.87 3F.1 | v48.58,101.6 49.85,102.87 76.83,102.87
N$8  (via drill 0.81)
  Top 0.406: 5E.11 82.55,44.45 82.55,44.13 83.5,43.18 85.09,43.18 v85.09,61.59 | 3F.12 97.79,97.79 97.79,64.77 4F.8
  Bottom 0.406: v85.09,61.59 85.72,62.23 95.25,62.23 4F.8
N$9  (via drill 0.81)
  Top 0.406: 5E.2 69.53,50.8 v69.53,60.33 | v60.64,62.23 59.69,63.18 59.69,76.52 58.74,77.47 56.83,77.47 v56.83,95.89 | 4F.9 95.25,64.77 95.25,61.91 97.79,59.37 97.79,50.48 96.84,49.53 95.57,49.53 95.57,48.9 94.93,48.26 v94.93,47.94 | v87.95,46.99 87.63,47.31 v87.63,51.75 | v82.87,50.8 81.6,49.53 v79.38,49.53
  Bottom 0.406: v69.53,60.33 67.63,62.23 v60.64,62.23 | v56.83,95.89 56.2,96.52 R2.1 | v94.93,47.94 93.98,46.99 v87.95,46.99 | v87.63,51.75 86.68,50.8 v82.87,50.8 | v79.38,49.53 78.11,50.8 5E.2
N$10  (via drill 0.81)
  Top 0.406: v89.85,67.31 90.17,67.63 90.17,69.85 4F.4 | 4C.1 42.55,89.53 42.55,93.98 43.5,94.93 v48.58,94.93 | v64.14,95.25 64.77,94.61 64.77,91.12 65.72,90.17 69.53,90.17 69.53,80.64 69.22,80.33 v69.22,66.04
  Bottom 0.406: v89.85,67.31 74.93,67.31 4E.6 v69.22,66.04 | v48.58,94.93 48.9,94.61 57.47,94.61 58.1,95.25 v64.14,95.25
N$11  (via drill 0.81)
  Top 0.406: v63.5,69.85 62.87,70.48 v62.87,99.06
  Bottom 0.406: 4E.4 73.34,70.8 67.31,70.8 66.36,69.85 v63.5,69.85 | 3D.3 v62.87,99.06
N$12  (via drill 0.81)
  Top 0.406: 3D.4 60.33,96.52 v60.33,97.79
  Bottom 0.406: v60.33,97.79 84.77,97.79 86.04,99.06 3F.3
N$13  (via drill 0.81)
  Top 0.406: v39.05,71.75 40.64,70.17 v40.64,68.26 | v54.93,66.99 54.61,67.31 54.61,71.44 53.98,72.07 v53.98,83.82 | v103.5,86.68 104.78,85.41 104.78,79.69 105.41,79.06 105.41,74.93 IC3.3
  Bottom 0.406: IC4.11 35.88,71.44 38.73,71.44 v39.05,71.75 | v40.64,68.26 41.59,67.31 43.5,67.31 46.04,64.77 52.7,64.77 v54.93,66.99 | v53.98,83.82 54.61,84.45 79.06,84.45 81.28,86.68 82.87,86.68 83.19,87 95.57,87 95.89,86.68 v103.5,86.68
N$14  (via drill 0.81)
  Top 0.406: v83.82,76.2 83.82,83.19 85.41,84.77 v85.41,91.76
  Bottom 0.406: v83.82,76.2 4E.13 | v85.41,91.76 86.36,92.71 95.25,92.71 3F.10
N$15  (via drill 0.81)
  Top 0.406: 4E.10 80.01,67.31 80.01,65.72 80.96,64.77 v82.55,64.77 | v131.13,64.77 131.44,64.45 131.44,37.15 130.81,36.51 130.81,24.45 v122.87,16.51
  Bottom 0.406: v82.55,64.77 114.3,64.77 114.62,65.09 120.97,65.09 121.28,64.77 v131.13,64.77 | v122.87,16.51 105.41,16.51 6E.6
N$16  (via drill 0.81)
  Top 0.406: v99.06,73.66 100.33,74.93 100.33,79.38 99.69,80.01 v99.69,102.87
  Bottom 0.406: v99.06,73.66 4F.12 | IC1.1 100.97,104.14 v99.69,102.87 115.57,102.87 SV1.3
N$17  (via drill 0.81)
  Top 0.406: 4E.1 74.93,77.47 74.93,72.71 v74.61,72.39 | v78.42,71.44 78.74,71.12 78.74,51.75 v79.38,51.12 | v86.36,49.53 86.68,49.21 86.68,36.2 v87.63,35.24 | v90.17,34.29 92.39,32.07 v92.39,17.78 | v105.09,13.97 105.41,14.29 105.41,24.13 6E.2
  Bottom 0.406: v74.61,72.39 75.56,71.44 v78.42,71.44 | v79.38,51.12 80.96,49.53 v86.36,49.53 | v87.63,35.24 88.58,34.29 v90.17,34.29 | v92.39,17.78 93.66,16.51 99.06,16.51 100.33,15.24 102.55,15.24 103.82,13.97 v105.09,13.97
N$18  (via drill 0.81)
  Top 0.406: 5F.10 95.25,41.91 95.25,40.32 96.2,39.37 97.79,39.37 97.79,40.64 102.87,45.72 102.87,46.04 104.14,47.31 6F.4 | 3F.8 94.93,90.49 v94.93,99.06 | v120.97,100.33 128.59,92.71 128.59,52.07 126.68,50.16 v126.68,49.53
  Bottom 0.406: v94.93,99.06 96.2,100.33 v120.97,100.33 | v126.68,49.53 108.27,49.53 107,48.26 6F.4
N$19  (via drill 0.81)
  Top 0.406: v104.14,34.61 109.54,40.01 109.54,42.86 110.49,43.81 110.49,49.53 6F.14
  Bottom 0.406: 5F.8 96.52,34.29 103.82,34.29 v104.14,34.61
N$20  (via drill 0.81)
  Top 0.406: v33.34,62.55 v33.34,80.01 | v92.08,58.1 92.08,47.94 94.3,45.72 5F.11
  Bottom 0.406: 4C.4 42.86,80.96 37.78,80.96 36.83,80.01 v33.34,80.01 | v33.34,62.55 37.78,58.1 v92.08,58.1
N$24
  Bottom 0.406: SV1.2 IC1.13
N$25  (via drill 0.81)
  Top 0.406: IC4.3 29.84,71.75 v29.84,66.04 | v32.07,64.77 32.07,82.23 v32.38,82.55 | v29.84,83.19 30.8,84.14 v30.8,88.58 | v64.14,90.17 64.77,89.53 64.77,85.72 v68.26,82.23
  Bottom 0.406: v29.84,66.04 31.11,64.77 v32.07,64.77 | v32.38,82.55 31.75,83.19 v29.84,83.19 | v30.8,88.58 32.38,90.17 v64.14,90.17 | v68.26,82.23 68.58,82.55 76.2,82.55 78.74,80.01 99.69,80.01 100.97,78.74 IC3.1
N$26  (via drill 0.81)
  Top 0.406: v4.76,51.12 4.76,75.25 7.3,77.79 7.3,84.45 6.99,84.77 6.99,100.33 8.57,101.92 v8.57,102.87 | v39.37,105.41 42.23,108.27 v42.23,108.58 | v57.47,108.58 60.33,108.58 62.23,110.49 86.36,110.49 v86.36,97.79 | v100.97,97.79 102.23,96.52 102.23,78.42 102.87,77.79 v102.87,75.25
  Bottom 0.406: IC7.6 26.04,42.55 13.34,42.55 v4.76,51.12 | v8.57,102.87 11.11,105.41 v39.37,105.41 | v42.23,108.58 42.55,108.9 57.15,108.9 v57.47,108.58 | v100.97,97.79 v86.36,97.79 | v102.87,75.25 101.92,76.2 4F.13
N$45  (via drill 0.81)
  Top 0.406: 5D.2 60.96,53.34 60.96,60.33 58.42,62.87 4D.7 | v72.71,26.67 71.44,27.94 v71.44,48.26
  Bottom 0.406: 6D.2 82.87,25.4 81.6,26.67 v72.71,26.67 | v71.44,48.26 70.17,49.53 59.69,49.53 5D.2
N$46  (via drill 0.81)
  Top 0.406: 67.31,41.91 5D.11 | 67.31,41.91 67.31,58.1 64.77,60.64 64.77,74.93 4D.15 | 6D.6 82.55,21.59 v82.55,31.43 | v70.17,32.7 67.31,35.56 67.31,41.91
  Bottom 0.406: v82.55,31.43 81.28,32.7 v70.17,32.7
N$47  (via drill 0.81)
  Top 0.406: v61.91,63.5 61.91,46.67 5D.5 63.18,38.42 63.18,33.97 v63.5,33.66 | 6D.4 84.14,25.08 v84.14,31.75
  Bottom 0.406: 4D.10 v61.91,63.5 | v84.14,31.75 81.92,33.97 63.82,33.97 v63.5,33.66
N$48  (via drill 0.81)
  Top 0.406: 4D.1 61.59,78.74 v61.59,88.9 | v44.45,34.29 44.45,52.07 5C.1 | v48.26,54.61 v48.26,77.47
  Bottom 0.406: 3D.8 v61.59,88.9 | 5B.1 11.75,28.89 4.76,28.89 2.86,30.8 2.86,37.78 11.11,37.78 14.92,33.97 28.57,33.97 28.89,34.29 v44.45,34.29 | 4D.1 58.1,78.42 52.07,78.42 51.12,77.47 v48.26,77.47 | v48.26,54.61 46.99,53.34 5C.1
N$50  (via drill 0.81)
  Top 0.406: IC2.3 31.43,28.89 31.43,43.81 31.11,44.13 31.11,47.94 v33.97,50.8 | v46.99,52.07 v46.99,67.31
  Bottom 0.406: v33.97,50.8 35.24,52.07 41.91,52.07 5C.2 45.72,50.8 v46.99,52.07 | 4D.5 58.1,68.26 52.07,68.26 51.12,67.31 v46.99,67.31
N$51  (via drill 0.81)
  Top 0.406: IC2.4 26.67,24.13 26.67,29.21 | v26.67,35.24 26.67,29.21 | v35.56,61.91 31.75,58.1 31.75,49.85 30.16,48.26 30.16,33.66 30.48,33.34 30.48,32.7 29.21,31.43 29.21,30.16 28.26,29.21 26.67,29.21
  Bottom 0.406: v26.67,35.24 26.99,35.56 39.37,35.56 41.91,38.1 5C.7 | 4D.12 65.72,68.26 59.69,68.26 58.74,67.31 56.83,67.31 51.75,62.23 35.88,62.23 v35.56,61.91
N$52  (via drill 0.81)
  Top 0.406: IC2.7 25.4,17.78 v25.4,36.51 | v55.88,69.85 56.2,69.53 v56.2,40.64
  Bottom 0.406: v25.4,36.51 39.05,36.51 41.91,39.37 49.53,39.37 5C.10 53.66,38.1 v56.2,40.64 | 4D.13 62.55,71.12 61.28,69.85 v55.88,69.85
N$53  (via drill 0.81)
  Top 0.406: IC2.8 22.86,17.78 v22.86,21.91 | v54.93,48.26 54.61,47.94 54.61,35.88 53.98,35.24 v53.98,24.13
  Bottom 0.406: 20.64,24.13 v22.86,21.91 | 20.64,24.13 13.97,24.13 5B.2 | 6B.2 57.15,24.13 v53.98,24.13 20.64,24.13 | v54.93,48.26 5D.3
N$54  (via drill 0.81)
  Top 0.406: 6B.4 60.96,22.86 60.96,31.43 59.69,32.7 59.69,35.88 58.74,36.83 57.15,36.83 57.15,39.37 5D.6 | v39.69,17.78 35.56,13.65 IC2.13
  Bottom 0.406: 5B.7 13.97,13.97 30.48,13.97 31.75,12.7 IC2.13 | 6B.4 58.1,20 52.07,20 51.12,19.05 40.96,19.05 v39.69,17.78
N$55  (via drill 0.81)
  Top 0.406: 5B.10 26.67,6.35 34.29,6.35 34.29,13.97 IC2.14 38.73,18.41 38.73,25.72 38.42,26.04 38.42,37.47 v38.73,37.78
  Bottom 0.406: 6B.6 52.39,15.24 51.12,16.51 36.83,16.51 IC2.14 | 5D.10 62.23,41.91 42.86,41.91 v38.73,37.78
N$59  (via drill 0.81)
  Top 0.406: IC2.11 35.24,7.3 35.24,6.03 31.75,2.54 9.53,2.54 9.53,39.05 7.94,40.64 7.94,52.7 8.57,53.34 8.57,57.47 8.26,57.78 8.26,71.12 v7.94,71.44 | v11.43,106.68 v11.43,74.93 | v53.98,106.36 56.52,106.36 56.83,106.68 58.42,106.68 58.42,105.73 61.59,102.55 v61.59,91.44
  Bottom 0.406: v11.43,74.93 v7.94,71.44 | v11.43,106.68 12.7,107.95 36.2,107.95 36.83,107.31 44.77,107.31 45.4,107.95 50.16,107.95 51.75,106.36 v53.98,106.36 | 3D.9 v61.59,91.44
N$70
  Top 0.406: 3E.8 79.38,90.81 79.38,99.38 74.61,104.14 3E.1
N$71  (via drill 0.81)
  Top 0.406: v86.36,76.2 86.68,76.52 86.68,95.89 81.28,101.28 3E.13
  Bottom 0.406: v86.36,76.2 4F.2
N$72
  Top 0.406: 3B.2 3B.3
N$74
  Bottom 0.406: 3B.4 33.97,96.52 35.24,97.79 58.74,97.79 60.01,96.52 3D.11
POPR
  Top 0.406: IC7.8 34.29,39.37 34.29,49.53 IC7.13
RUN  (via drill 0.81)
  Top 0.406: IC7.9 36.51,41.59 36.51,42.55 36.83,42.86 36.83,72.39 IC4.12 | v131.13,67.31 130.81,67.63 v130.81,106.68 | v26.67,112.39 19.05,104.78 19.05,87 21.91,84.14 v21.91,74.61
  Bottom 0.406: PL1.11 123.19,67.31 v131.13,67.31 | v130.81,106.68 123.83,113.67 27.94,113.67 v26.67,112.39 | v21.91,74.61 22.23,74.93 34.29,74.93 IC4.12
UB  (via drill 0.81)
  Top 0.406: IC1.5 105.73,95.57 v105.73,99.06
  Bottom 0.406: IC1.12 v105.73,99.06
USER_MODE  (via drill 0.81)
  Top 0.406: IC7.2 IC7.1 30.8,53.34 30.8,65.41 31.11,65.72 31.11,83.19 32.07,84.14 v32.07,97.79 | 5F.4 90.17,46.99 90.17,49.53 5F.2 | v107.95,53.66 107.95,87.63 v108.9,88.58 107,90.49 107,108.58 v106.68,108.9 | v101.28,52.7 100.01,51.44 v100.01,46.04 | v50.16,104.14 58.74,112.71 100.01,112.71 v100.01,109.54
  Bottom 0.406: v108.9,88.58 IC1.9 | v107.95,53.66 106.36,52.07 101.92,52.07 v101.28,52.7 | v100.01,46.04 99.69,46.35 97.47,46.35 96.84,46.99 95.57,46.99 94.3,45.72 5F.4 | v32.07,97.79 34.61,100.33 41.59,100.33 45.4,104.14 v50.16,104.14 | v100.01,109.54 100.65,108.9 v106.68,108.9
VCC  (via drill 0.81)
  Top 0.406: C10.1 66.04,80.01 4D.16 | 4E.14 80.01,80.01 C11.1 | IC1.10 110.49,95.25 110.49,102.87 IC1.14 | v99.06,78.74 98.74,79.06 98.74,101.92 3F.14 96.52,105.41 C6.1 | 4A.16 20,79.06 20,80.33 C7.1 | 3D.10 67.31,95.25 67.31,97.79 3D.12 64.77,100.33 C4.1 66.04,105.41 3D.14 | 3E.14 80.01,105.41 C5.1 | 4C.24 50.8,90.17 C9.1 49.85,91.76 49.85,95.57 | IC4.14 34.61,79.69 34.61,80.96 C8.1 34.29,100.33 | R1.2 R2.2 48.26,104.46 49.85,102.87 49.85,95.57 | 34.29,105.41 3B.14 | C3.1 34.29,105.41 | 34.29,105.41 34.29,100.33 | 49.85,95.57 3D.1 | 34.29,100.33 v33.02,100.33 | C24.1 96.52,29.21 6D.16 | C23.1 81.28,29.21 6C.16 | C22.1 66.04,29.21 6B.16 | C21.1 50.8,29.21 4B.16 | C20.1 35.56,31.75 IC2.20 | 5B.13 19.05,21.59 19.05,27.94 | 19.05,27.94 C19.1 C13.1 19.05,57.47 17.46,59.05 17.46,78.11 v17.78,78.42 | 19.05,27.94 5B.16 | C17.1 81.28,54.61 5E.14 | C18.1 96.52,54.61 5F.14 | IC7.14 34.29,54.61 C14.1 | C16.1 66.04,54.61 5D.16 | v53.34,45.72 53.02,46.04 53.02,53.02 v53.34,53.34 | 4D.4 57.15,69.85 57.15,57.15 v57.47,56.83 | 4B.1 42.23,28.89 v42.23,30.48
  Bottom 0.406: 113.35,80.33 114.3,81.28 PL1.1 | 113.35,80.33 IC3.14 | 113.35,80.33 112.08,81.6 95.57,81.6 C12.1 94.93,80.96 92.08,80.96 90.49,82.55 86.36,82.55 85.09,81.28 C11.1 78.74,81.28 76.52,83.5 66.99,83.5 C10.1 63.5,82.55 46.35,82.55 43.81,80.01 38.1,80.01 36.83,78.74 IC4.14 | v99.06,78.74 4F.14 | IC1.14 109.54,106.36 95.57,106.36 C6.1 | C7.1 14.61,85.72 9.21,85.72 2.54,92.39 2.54,101.6 C2.+ 8.89,101.6 10.16,102.87 19.05,102.87 IC6.14 24.13,100.33 v33.02,100.33 | 3D.14 3D.1 | C5.1 78.74,107.95 66.04,107.95 C4.1 | R1.2 43.18,104.14 3B.14 | 3F.14 92.71,100.33 68.58,100.33 67.31,99.06 3D.12 | 111.44,28.26 110.49,29.21 103.82,29.21 103.19,28.57 98.42,28.57 97.79,27.94 6D.16 90.49,27.94 89.22,29.21 82.55,29.21 6C.16 | PL1.40 128.91,33.02 129.86,32.07 129.86,28.26 111.44,28.26 | 111.44,28.26 6E.16 | 4B.16 4B.1 | 6B.16 65.72,28.26 59.69,28.26 57.47,30.48 C21.1 | C23.1 78.74,31.75 70.8,31.75 69.53,30.48 C22.1 | C20.1 33.02,31.75 20.32,31.75 C19.1 | C1.+ 5.08,29.84 13.02,29.84 14.92,27.94 5B.16 | 6F.16 6F.1 C18.1 93.98,54.61 82.55,54.61 5E.14 80.96,53.66 74.93,53.66 72.71,55.88 C16.1 64.45,55.56 61.59,55.56 60.01,57.15 57.78,57.15 v57.47,56.83 53.98,53.34 v53.34,53.34 52.07,53.34 | 6F.3 103.82,51.12 101.28,51.12 99.06,53.34 5F.14 | C14.1 33.02,57.15 20.32,57.15 C13.1 16.51,55.88 16.51,62.55 13.34,65.72 13.02,65.72 4A.6 | v53.34,45.72 5C.13 | 5C.16 52.07,53.34 | 52.07,53.34 C15.1 47.94,55.88 46.67,54.61 36.83,54.61 IC7.14 | IC2.20 v42.23,30.48 | 4A.16 20,78.42 v17.78,78.42
XTA  (via drill 0.81)
  Top 0.406: v102.55,101.6 102.87,101.92 102.87,106.68 107.31,111.12 117.47,111.12 117.47,105.41 118.75,104.14 118.75,79.69 119.38,79.06 v119.38,77.47
  Bottom 0.406: v102.55,101.6 3F.13 | v119.38,77.47 123.19,77.47 PL1.6
XTC  (via drill 0.81)
  Top 0.406: 3B.5 25.72,96.2 v25.72,109.22 | v108.9,108.58 115.57,101.92 v115.57,76.2
  Bottom 0.406: v25.72,109.22 26.35,109.86 36.2,109.86 36.51,110.17 40.96,110.17 41.59,110.81 86.04,110.81 86.68,110.17 99.06,110.17 99.69,110.81 106.68,110.81 v108.9,108.58 | PL1.5 v115.57,76.2

## Text on the board
Bottom: EMC6907 MMU